# EAGLE schematic sensordio (EAGLE 6.2)
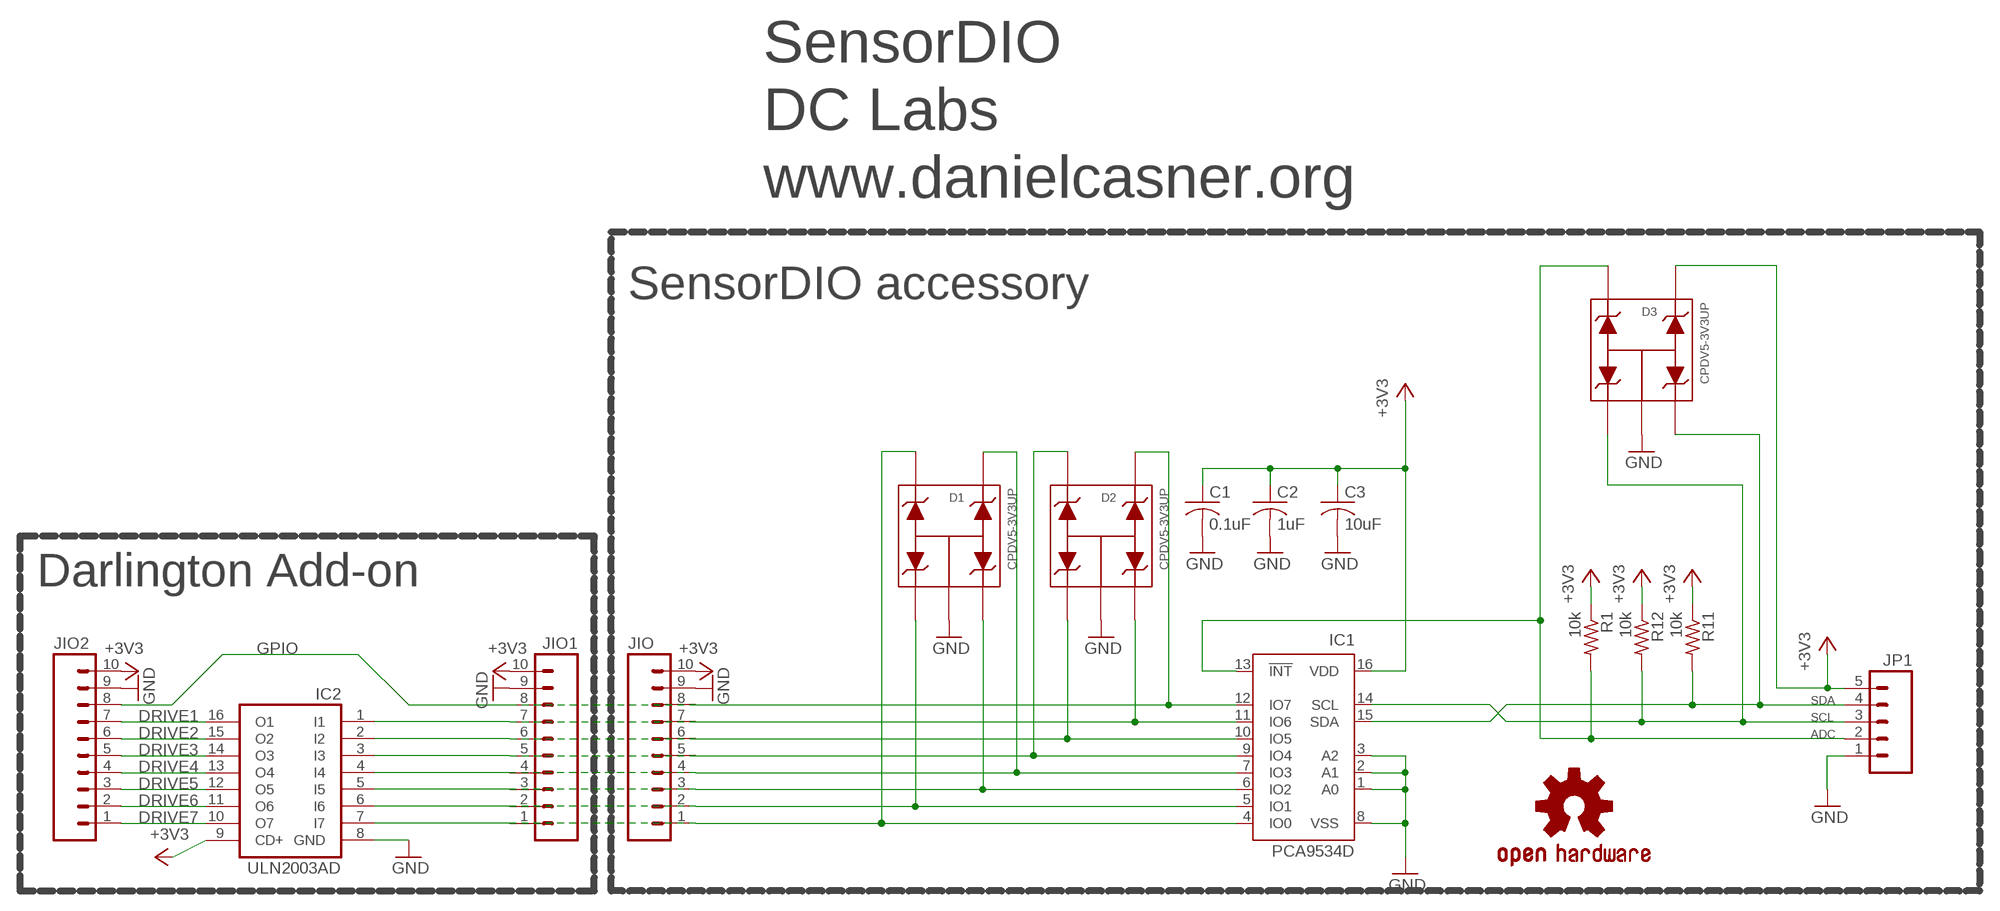
[diagram p0: schematic, sheet 1]

## Parts
C1  0.1uF  C-USC0805  [C0805]
C2  1uF  C-USC0805  [C0805]
C3  10uF  C-USC0805  [C0805]
D1  CPDV5-3V3UP  CPDV5  [SOT353]
D2  CPDV5-3V3UP  CPDV5  [SOT353]
D3  CPDV5-3V3UP  CPDV5  [SOT353]
IC1  PCA9534D  [SO16W]
IC2  ULN2003AD  [SO16]
JIO  M10  [10P]
JIO1  M10  [10P]
JIO2  M10  [10P]
JP1  M05PTH_LONGPADS  [1X05_LONGPADS]
R1  10k  R-US_R0402  [R0402]
R11  10k  R-US_R0402  [R0402]
R12  10k  R-US_R0402  [R0402]
U$1  OSHW-LOGOS  [OSHW-LOGO-S]

## Nets
+3V3: C1.1 C2.1 C3.1 D3.4 IC1.16(VDD) IC2.9(CD+) JIO1.10 JIO2.10 JIO.10 JP1.5 R1.1 R11.1 R12.1
ADC: D3.5 IC1.13(!INT) JP1.2 R1.2
DRIVE1: IC2.16(O1) JIO2.7
DRIVE2: IC2.15(O2) JIO2.6
DRIVE3: IC2.14(O3) JIO2.5
DRIVE4: IC2.13(O4) JIO2.4
DRIVE5: IC2.12(O5) JIO2.3
DRIVE6: IC2.11(O6) JIO2.2
DRIVE7: IC2.10(O7) JIO2.1
GND: C1.2 C2.2 C3.2 D1.2 D2.2 D3.2 IC1.1(A0) IC1.2(A1) IC1.3(A2) IC1.8(VSS) IC2.8(GND) JIO1.9 JIO2.9 JIO.9 JP1.1
GPIO: D2.4 IC1.12(IO7) JIO1.8 JIO2.8 JIO.8
N$1: D1.5 IC1.4(IO0) IC2.7(I7) JIO1.1 JIO.1
N$3: D1.1 IC1.5(IO1) IC2.6(I6) JIO1.2 JIO.2
N$4: D1.3 IC1.6(IO2) IC2.5(I5) JIO1.3 JIO.3
N$5: D1.4 IC1.7(IO3) IC2.4(I4) JIO1.4 JIO.4
N$6: D2.5 IC1.9(IO4) IC2.3(I3) JIO1.5 JIO.5
N$7: D2.1 IC1.10(IO5) IC2.2(I2) JIO1.6 JIO.6
N$8: D2.3 IC1.11(IO6) IC2.1(I1) JIO1.7 JIO.7
SCL: D3.1 IC1.14(SCL) JP1.3 R12.2
SDA: D3.3 IC1.15(SDA) JP1.4 R11.2

## Notes on the sheet
- SensorDIO
- DC Labs
- www.danielcasner.org
- SensorDIO accessory
- Darlington Add-on

## Library data of the parts
C1-C3 = rcl:C-US: CAPACITOR, American symbol
D1-D3 = DMM:CPDV5: SMD ESD Protection Diode
IC1 = micro-philips:PCA9534: 8-bit I2C-bus and SMBus low power I/O port with interrupt Source: www.nxp.com .. PCA9534_3.pdf; MPN: PCA9534DB; OC_FARNELL: 1408284; OC_NEWARK: 18M7513
IC2 = uln-udn:ULN2003A: DRIVER ARRAY
JIO JIO1 JIO2 = con-amp-quick:M10: AMP QUICK CONNECTOR; OC_FARNELL: unknown; OC_NEWARK: unknown
JP1 = SparkFun-Connectors:M05: Header 5 Standard 5-pin 0.1" header. Use with straight break away headers (SKU : PRT-00116), right angle break away headers (PRT-00553), swiss pins (PRT-00743), machine pins (PRT-00117), and female headers (PRT-00115). Molex polarized connector foot print use with SKU : PRT-08230 with associated crimp pins and housings.
R1 R11 R12 = rcl:R-US_: RESISTOR, American symbol
U$1 = SparkFun-Aesthetics:OSHW-LOGO: Open Source Hardware Logo This logo indicates the piece of hardware it is found on incorporates a OSHW license and/or adheres to the definition of open source hardware found here: http://freedomdefined.org/OSHW